# EAGLE design HackmodWear_workingcopy2 (EAGLE 9.2.0)
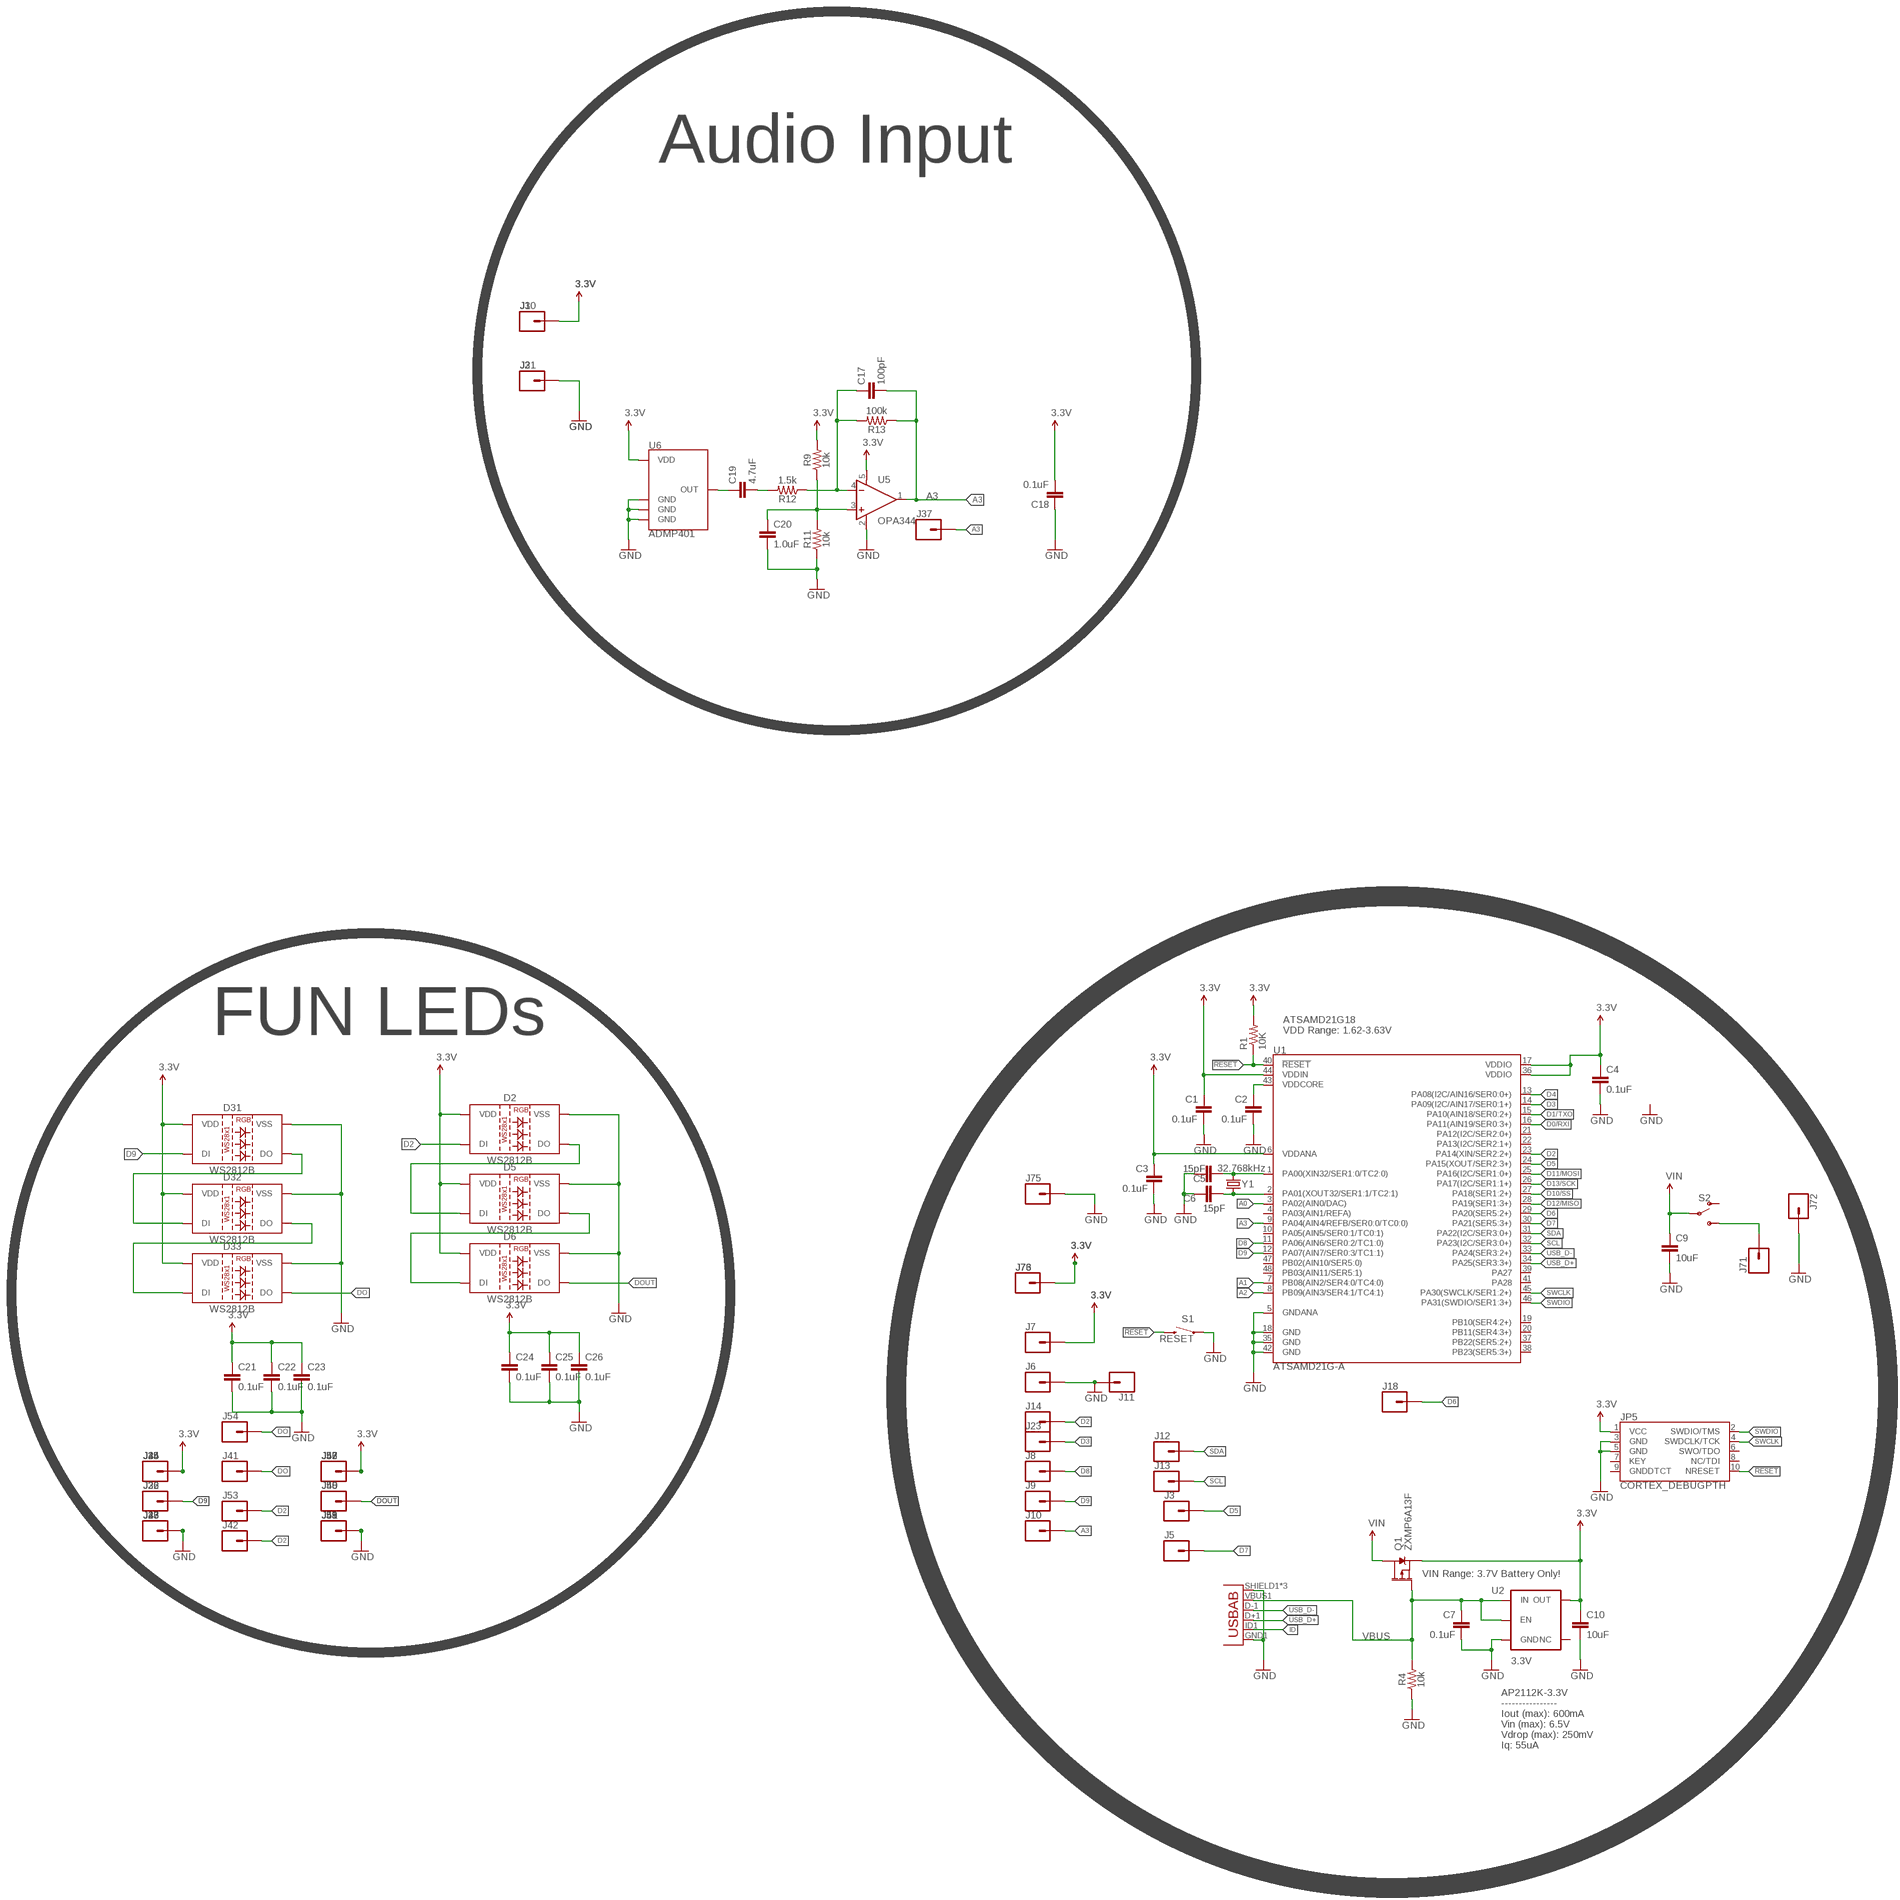
[diagram p0: schematic, sheet 1, part 1 of 3]
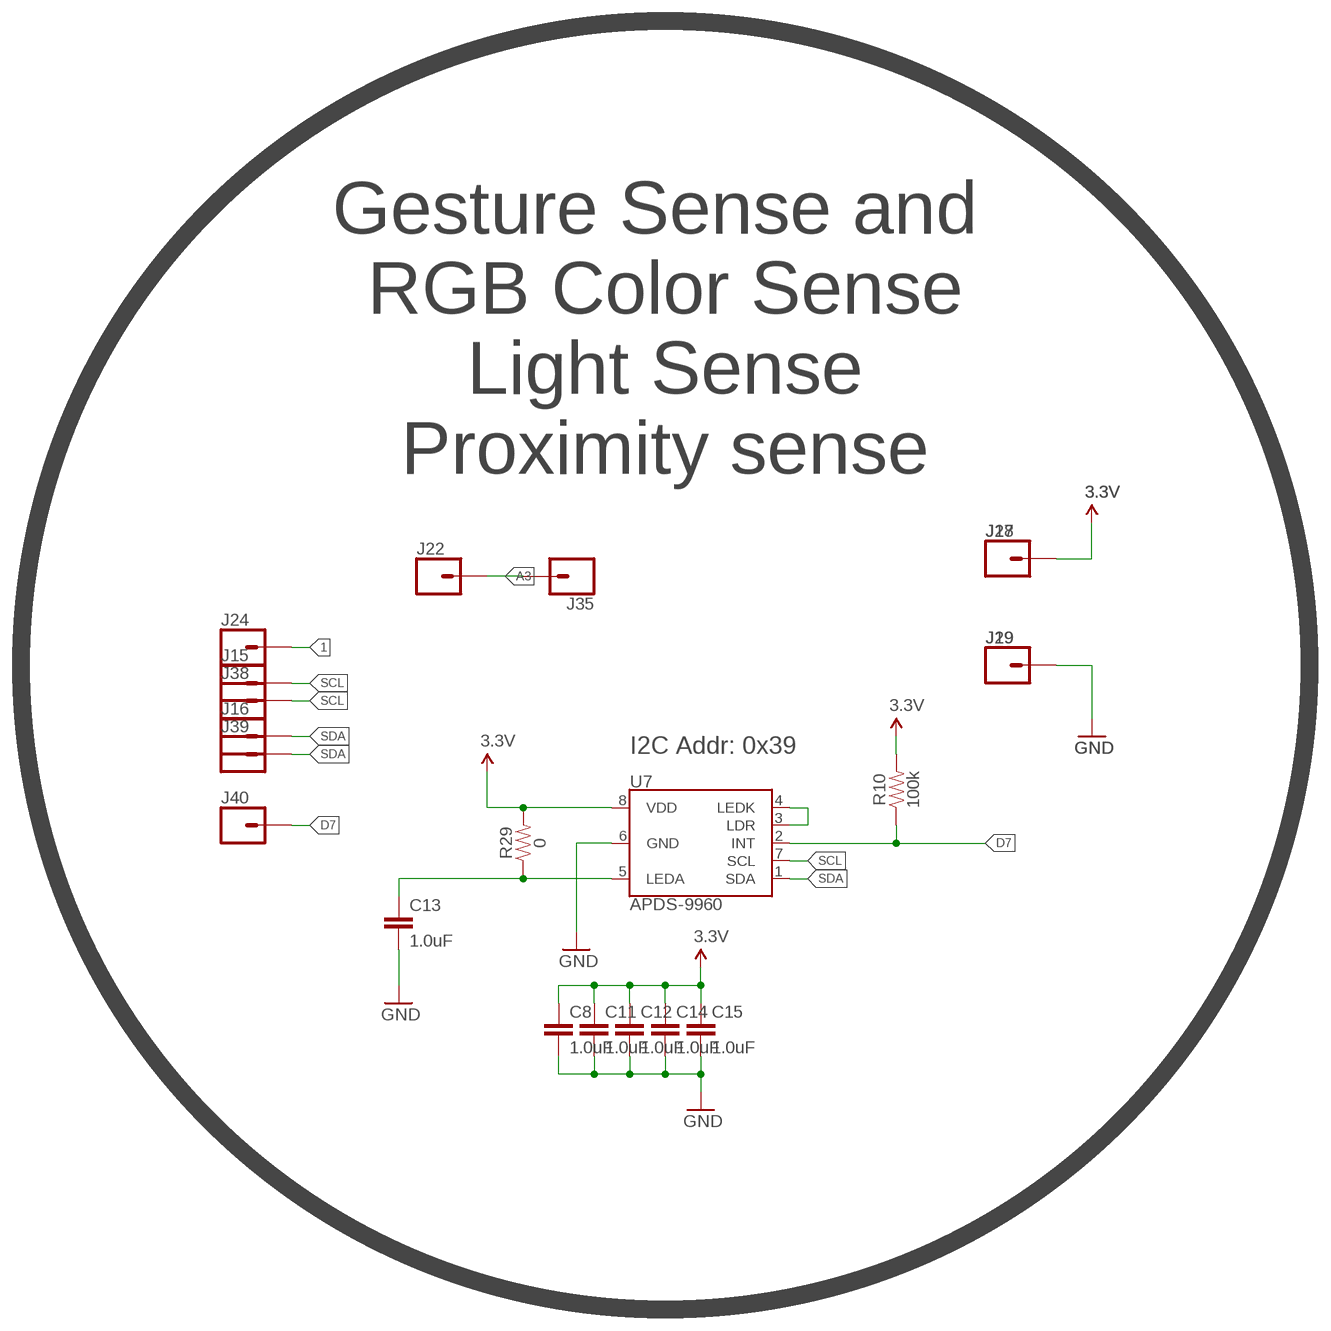
[diagram p1: schematic, sheet 1, part 2 of 3]
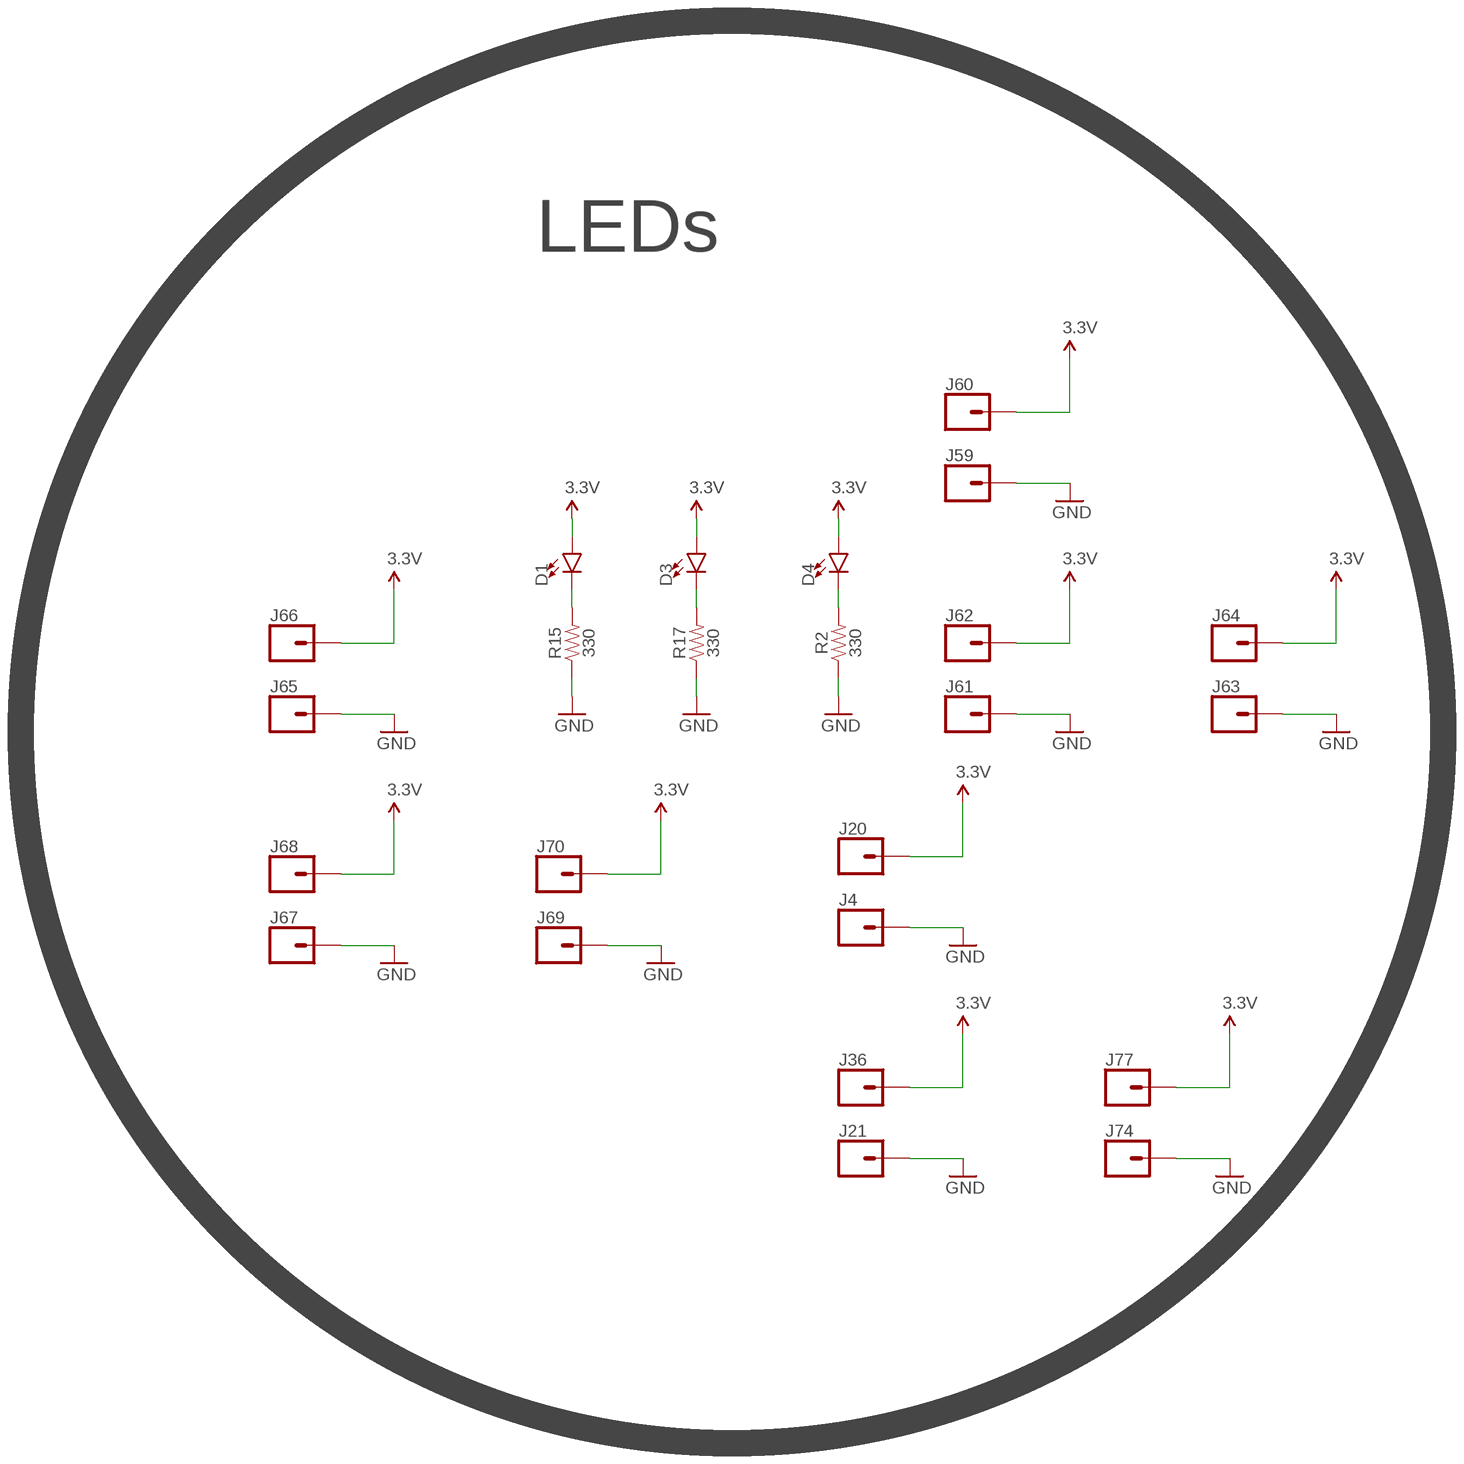
[diagram p2: schematic, sheet 1, part 3 of 3]

## Parts
C1  0.1uF  0.1UF-0603-25V-(+80/-20%)  [0603]
C2  0.1uF  0.1UF-0603-25V-(+80/-20%)  [0603]
C3  0.1uF  0.1UF-0603-25V-(+80/-20%)  [0603]
C4  0.1uF  0.1UF-0603-25V-(+80/-20%)  [0603]
C5  15pF  15PF-0603-50V-5%  [0603]
C6  15pF  15PF-0603-50V-5%  [0603]
C7  0.1uF  0.1UF-0603-25V-(+80/-20%)  [0603]
C8  1.0uF  1.0UF-0603-16V-10%  [0603]
C9  10uF  10UF-0603-6.3V-20%  [0603]
C10  10uF  10UF-0603-6.3V-20%  [0603]
C11  1.0uF  1.0UF-0603-16V-10%  [0603]
C12  1.0uF  1.0UF-0603-16V-10%  [0603]
C13  1.0uF  1.0UF-0603-16V-10%  [0603]
C14  1.0uF  1.0UF-0603-16V-10%  [0603]
C15  1.0uF  1.0UF-0603-16V-10%  [0603]
C17  100pF  100PF-0603-50V-5%  [0603]
C18  0.1uF  0.1UF-0603-25V-(+80/-20%)  [0603]
C19  4.7uF  4.7UF0603  [0603]
C20  1.0uF  1.0UF-0603-16V-10%  [0603]
C21  0.1uF  0.1UF-0603-25V-(+80/-20%)  [0603]
C22  0.1uF  0.1UF-0603-25V-(+80/-20%)  [0603]
C23  0.1uF  0.1UF-0603-25V-(+80/-20%)  [0603]
C24  0.1uF  0.1UF-0603-25V-(+80/-20%)  [0603]
C25  0.1uF  0.1UF-0603-25V-(+80/-20%)  [0603]
C26  0.1uF  0.1UF-0603-25V-(+80/-20%)  [0603]
D1  LED1206  [LED-1206]
D2  WS2812B  [WS2812B]
D3  LED1206  [LED-1206]
D4  LED1206  [LED-1206]
D5  WS2812B  [WS2812B]
D6  WS2812B  [WS2812B]
D31  WS2812B  [WS2812B]
D32  WS2812B  [WS2812B]
D33  WS2812B  [WS2812B]
J1  CONN_01  [1X01]
J2  CONN_01  [1X01]
J3  CONN_01  [1X01]
J4  CONN_01  [1X01]
J5  CONN_01  [1X01]
J6  CONN_01  [1X01]
J7  CONN_01  [1X01]
J8  CONN_01  [1X01]
J9  CONN_01  [1X01]
J10  CONN_01  [1X01]
J11  CONN_01  [1X01]
J12  CONN_01  [1X01]
J13  CONN_01  [1X01]
J14  CONN_01  [1X01]
J15  CONN_01  [1X01]
J16  CONN_01  [1X01]
J17  CONN_01  [1X01]
J18  CONN_01  [1X01]
J19  CONN_01  [1X01]
J20  CONN_01  [1X01]
J21  CONN_01  [1X01]
J22  CONN_01  [1X01]
J23  CONN_01  [1X01]
J24  CONN_01  [1X01]
J25  CONN_01  [1X01]
J26  CONN_01  [1X01]
J27  CONN_01  [1X01]
J28  CONN_01  [1X01]
J29  CONN_01  [1X01]
J30  CONN_01  [1X01]
J31  CONN_01  [1X01]
J32  CONN_01  [1X01]
J33  CONN_01  [1X01]
J34  CONN_01  [1X01]
J35  CONN_01  [1X01]
J36  CONN_01  [1X01]
J37  CONN_01  [1X01]
J38  CONN_01  [1X01]
J39  CONN_01  [1X01]
J40  CONN_01  [1X01]
J41  CONN_01  [1X01]
J42  CONN_01  [1X01]
J43  CONN_01  [1X01]
J44  CONN_01  [1X01]
J45  CONN_01  [1X01]
J46  CONN_01  [1X01]
J47  CONN_01  [1X01]
J48  CONN_01  [1X01]
J49  CONN_01  [1X01]
J50  CONN_01  [1X01]
J51  CONN_01  [1X01]
J52  CONN_01  [1X01]
J53  CONN_01  [1X01]
J54  CONN_01  [1X01]
J55  CONN_01  [1X01]
J56  CONN_01  [1X01]
J57  CONN_01  [1X01]
J58  CONN_01  [1X01]
J59  CONN_01  [1X01]
J60  CONN_01  [1X01]
J61  CONN_01  [1X01]
J62  CONN_01  [1X01]
J63  CONN_01  [1X01]
J64  CONN_01  [1X01]
J65  CONN_01  [1X01]
J66  CONN_01  [1X01]
J67  CONN_01  [1X01]
J68  CONN_01  [1X01]
J69  CONN_01  [1X01]
J70  CONN_01  [1X01]
J71  CONN_01  [1X01]
J72  CONN_01  [1X01]
J73  CONN_01  [1X01]
J74  CONN_01  [1X01]
J75  CONN_01  [1X01]
J76  CONN_01  [1X01]
J77  CONN_01  [1X01]
JP3  USB-ABCONN-11794  [USB-AB-MICRO-SMD_V03]
JP5  CORTEX_DEBUGPTH  [2X5-PTH-1.27MM]
Q1  ZXMP6A13F  MOSFET_PCH-SI2309DS  [SOT23-3]
R1  10K  10KOHM-1/10W-1%(0603)0603  [0603-RES@1]
R2  330  330OHM-0603-1/10W-1%  [0603]
R4  10k  10KOHM-0603-1/10W-1%  [0603]
R9  10k  10KOHM-0603-1/10W-1%  [0603]
R10  100k  100KOHM-0603-1/10W-1%  [0603]
R11  10k  10KOHM-0603-1/10W-1%  [0603]
R12  1.5k  1.5KOHM-0603-1/10W-1%  [0603]
R13  100k  100KOHM-0603-1/10W-1%  [0603]
R15  330  330OHM-0603-1/10W-1%  [0603]
R17  330  330OHM-0603-1/10W-1%  [0603]
R29  0  0OHM-0603-1/10W-5%  [0603]
S1  RESET  SWITCH-MOMENTARY-2SMD-4.6X2.8MM  [TACTILE_SWITCH_SMD_4.6X2.8MM]
S2  SWITCH-SPDT-SMD-RIGHT-ANGLE  [SWITCH_SPST_SMD_A]
U1  ATSAMD21G-A  [TQFP-48]
U2  3.3V  V_REG_AP2112K-3.3V  [SOT23-5]
U5  OPA344  [SOT23-5]
U6  ADMP401  [ADMP401]
U7  APDS-9960  [APDS-9960]
Y1  32.768kHz  CRYSTAL3.2X1.5MM  [CRYSTAL-SMD-3.2X1.5MM]

## Nets
1: J24.P$1
3.3V: C1.1 C4.1 C8.1 C10.1 C11.1 C12.1 C14.1 C15.1 C18.2 C21.1 C22.1 C23.1 C24.1 C25.1 C26.1 D1.A D2.1(VDD) D3.A D4.A D5.1(VDD) D6.1(VDD) D31.1(VDD) D32.1(VDD) D33.1(VDD) J1.P$1 J7.P$1 J17.P$1 J20.P$1 J25.P$1 J28.P$1 J30.P$1 J34.P$1 J36.P$1 J44.P$1 J45.P$1 J47.P$1 J52.P$1 J56.P$1 J57.P$1 J60.P$1 J62.P$1 J64.P$1 J66.P$1 J68.P$1 J70.P$1 J73.P$1 J76.P$1 J77.P$1 JP5.1(VCC) Q1.2(S) R1.2 R9.2 R10.2 R29.2 U1.17(VDDIO) U1.36(VDDIO) U1.44(VDDIN) U2.5(OUT) U5.5(V+) U6.5(VDD) U7.8(VDD)
!RESET: JP5.10(NRESET) R1.1 S1.3 S1.4 U1.40(!RESET!)
A0: U1.3(PA02(AIN0/DAC))
A1: U1.7(PB08(AIN2/SER4:0/TC4:0))
A2: U1.8(PB09(AIN3/SER4:1/TC4:1))
A3: C17.2 J10.P$1 J22.P$1 J35.P$1 J37.P$1 R13.1 U1.9(PA04(AIN4/REFB/SER0:0/TC0:0)) U5.1(OUT)
D0/RXI: U1.16(PA11(AIN19/SER0:3+))
D1/TXO: U1.15(PA10(AIN18/SER0:2+))
D2: D2.4(DI) J14.P$1 J42.P$1 J53.P$1 U1.23(PA14(XIN/SER2:2+))
D3: J23.P$1 U1.14(PA09(I2C/AIN17/SER0:1+))
D4: U1.13(PA08(I2C/AIN16/SER0:0+))
D5: J3.P$1 U1.24(PA15(XOUT/SER2:3+))
D6: J18.P$1 U1.29(PA20(SER5:2+))
D7: J5.P$1 J40.P$1 R10.1 U1.30(PA21(SER5:3+)) U7.2(INT)
D8: J8.P$1 U1.11(PA06(AIN6/SER0:2/TC1:0))
D9: D31.4(DI) J9.P$1 J26.P$1 J32.P$1 U1.12(PA07(AIN7/SER0:3/TC1:1))
D10/SS: U1.27(PA18(SER1:2+))
D11/MOSI: U1.25(PA16(I2C/SER1:0+))
D12/MISO: U1.28(PA19(SER1:3+))
D13/SCK: U1.26(PA17(I2C/SER1:1+))
DO: D33.2(DO) J41.P$1 J54.P$1
DOUT: D6.2(DO) J48.P$1 J50.P$1
GND: C1.2 C2.2 C3.2 C4.2 C5.1 C6.2 C7.2 C8.2 C9.2 C10.2 C11.2 C12.2 C13.2 C14.2 C15.2 C18.1 C20.2 C21.2 C22.2 C23.2 C24.2 C25.2 C26.2 D2.3(VSS) D5.3(VSS) D6.3(VSS) D31.3(VSS) D32.3(VSS) D33.3(VSS) J2.P$1 J4.P$1 J6.P$1 J11.P$1 J19.P$1 J21.P$1 J27.P$1 J29.P$1 J31.P$1 J33.P$1 J43.P$1 J46.P$1 J49.P$1 J51.P$1 J55.P$1 J58.P$1 J59.P$1 J61.P$1 J63.P$1 J65.P$1 J67.P$1 J69.P$1 J72.P$1 J74.P$1 J75.P$1 JP3.GND1(GND) JP3.SHIELD1(SHIELD) JP3.SHIELD2(SHIELD) JP3.SHIELD3(SHIELD) JP5.3(GND) JP5.5(GND) R2.1 R4.1 R11.1 R15.1 R17.1 S1.1 S1.2 U1.5(GNDANA) U1.18(GND) U1.35(GND) U1.42(GND) U2.2(GND) U5.2(V-) U6.2(GND) U6.4(GND) U6.6(GND) U7.6(GND)
ID: JP3.ID1(USBID)
LEDA: C13.1 R29.1 U7.5(LEDA)
N$1: D4.C R2.2
N$2: C5.2 U1.1(PA00(XIN32/SER1:0/TC2:0)) Y1.P$2
N$3: C19.1 U6.1(OUT)
N$4: C6.1 U1.2(PA01(XOUT32/SER1:1/TC2:1)) Y1.P$1
N$5: U7.3(LDR) U7.4(LEDK)
N$6: C17.1 R12.1 R13.2 U5.4(-IN)
N$10: C19.2 R12.2
N$11: C20.1 R9.1 R11.2 U5.3(+IN)
N$12: D1.C R15.2
N$14: D31.2(DO) D32.4(DI)
N$15: D3.C R17.2
N$16: D32.2(DO) D33.4(DI)
N$21: J71.P$1 S2.3(S)
N$22: D2.2(DO) D5.4(DI)
N$23: D5.2(DO) D6.4(DI)
SCL: J13.P$1 J15.P$1 J38.P$1 U1.32(PA23(I2C/SER3:0+)) U7.7(SCL)
SDA: J12.P$1 J16.P$1 J39.P$1 U1.31(PA22(I2C/SER3:0+)) U7.1(SDA)
SWCLK: JP5.4(SWDCLK/TCK) U1.45(PA30(SWCLK/SER1:2+))
SWDIO: JP5.2(SWDIO/TMS) U1.46(PA31(SWDIO/SER1:3+))
USB_D+: JP3.D+1(D+) U1.34(PA25(SER3:3+))
USB_D-: JP3.D-1(D-) U1.33(PA24(SER3:2+))
VBUS: C7.1 JP3.VBUS1(VBUS) Q1.1(G) R4.2 U2.1(IN) U2.3(EN)
VDDANA: C3.1 U1.6(VDDANA) ; supply symbol labelled 3.3V
VDDCORE: C2.1 U1.43(VDDCORE)
VIN: C9.1 Q1.3(D) S2.2(P)
Unconnected: JP5.6(SWO/TDO) JP5.7(KEY) JP5.8(NC/TDI) JP5.9(GNDDTCT) S2.1(O) U1.4(PA03(AIN1/REFA)) U1.10(PA05(AIN5/SER0:1/TC0:1)) U1.19(PB10(SER4:2+)) U1.20(PB11(SER4:3+)) U1.21(PA12(I2C/SER2:0+)) U1.22(PA13(I2C/SER2:1+)) U1.37(PB22(SER5:2+)) U1.38(PB23(SER5:3+)) U1.39(PA27) U1.41(PA28) U1.47(PB02(AIN10/SER5:0)) U1.48(PB03(AIN11/SER5:1)) U2.4(NC)

## Notes on the sheet
- Audio Input
- ATSAMD21G18
  VDD Range: 1.62-3.63V
- FUN LEDs
- LEDs
- VIN Range: 3.7V Battery Only!
- AP2112K-3.3V
  ----------------
  Iout (max): 600mA 
  Vin (max): 6.5V
  Vdrop (max): 250mV
  Iq: 55uA
- Gesture Sense and 
  RGB Color Sense
  Light Sense
  Proximity sense
- I2C Addr: 0x39

## Library data of the parts
C1-C4 C7 C18 C21-C26 = SparkFun-Capacitors:0.1UF: 0.1µF ceramic capacitors A capacitor is a passive two-terminal electrical component used to store electrical energy temporarily in an electric field.; PROD_ID: CAP-00810
C5 C6 = SparkFun-Capacitors:15PF: 15pF ceramic capacitors A capacitor is a passive two-terminal electrical component used to store electrical energy temporarily in an electric field.; PROD_ID: CAP-07881
C8 C11-C15 C20 = SparkFun-Capacitors:1.0UF: 1µF ceramic capacitors A capacitor is a passive two-terminal electrical component used to store electrical energy temporarily in an electric field.; PROD_ID: CAP-00868
C9 C10 = SparkFun-Capacitors:10UF: 10.0µF ceramic capacitors A capacitor is a passive two-terminal electrical component used to store electrical energy temporarily in an electric field.; PROD_ID: CAP-11015
C17 = SparkFun-Capacitors:100PF: 100pF/0.1nF ceramic capacitors A capacitor is a passive two-terminal electrical component used to store electrical energy temporarily in an electric field.; PROD_ID: CAP-07883
C19 = SparkFun-Capacitors:4.7UF: 4.7µF ceramic capacitors A capacitor is a passive two-terminal electrical component used to store electrical energy temporarily in an electric field.; PROD_ID: CAP-08280
D1 D3 D4 = SparkFun-LED:LED: LED (Generic) Standard schematic elements and footprints for 5mm, 3mm, 1206, and 0603 sized LEDs. Generic LEDs with no color specified.
D2 D5 D6 D31-D33 = SparkFun-LED:WS2812B: WS2812B SMD addressable RGB LED 5x5mm SMD LED with built-in controller IC. Color: Red/Green/Blue mC Rating: RGB: 390, 660, 180 mcd Forward Voltage: RGB: 2.0, 3.0, 3.0 V Packages:WS2812B SparkFun Products: Blynk Board - ESP8266 <https://www.sparkfun.com/products/13794>; PROD_ID: DIO-12503
J1-J77 = SparkFun-Connectors:CONN_01: Single connection point. Often used as Generic Header-pin footprint for 0.1 inch spaced/style header connections On any of the 0.1 inch spaced packages, you can populate with these: Break Away Headers - Straight <https://www.sparkfun.com/products/116> (PRT-00116) Break Away Male Headers - Right Angle <https://www.sparkfun.com/products/553> (PRT-00553) Female Headers <https://www.sparkfun.com/products/115> (PRT-00115) Break Away Headers - Machine Pin <https://www.sparkfun.com/products/117> (PRT-00117) Break Away Female Headers - Swiss Machine Pin <https://www.sparkfun.com/products/743> (PRT-00743) This device is also useful as a general connection point to wire up your design to another part of your project. Our various solder wires solder well into these plated through hole pads. Hook-Up Wire - Assortment (Stranded, 22 AWG) <https://www.sparkfun.com/products/11375> (PRT-11375) Hook-Up Wire - Assortment (Solid Core, 22 AWG) <https://www.sparkfun.com/products/11367> (PRT-11367) View the entire wire category on our website here <https://www.sparkfun.com/categories/141> Special notes: SMTSO-256-ET is a "flush mount" nut for a 4-40 screw. We mostly use this on specialty testbeds; it is a nice way to connect hardware to your PCB at an adjustable hieght. Also note, the SNAP packages are for using a snappable style connector. We sell a baggie of snaps and they are also used on two LilyPad designs: Snap Assortment - 30 pack (male and female) <https://www.sparkfun.com/products/11347> (DEV-11347) LilyPad Arduino SimpleSnap <https://www.sparkfun.com/products/10941> (DEV-10941) LilyPad SimpleSnap Protoboard <https://www.sparkfun.com/products/10940> (DEV-10940)
JP3 = SparkFun-Connectors:USB-AB: This is a USB AB connector that is compatible with USB OTG. i.e. this connector can serve as a host or device; PROD_ID: CONN-11794
JP5 = samd21-temp:CORTEX_DEBUG: Cortex Debug Connector Datasheet <http://infocenter.arm.com/help/topic/com.arm.doc.faqs/attached/13634/cortex_debug_connectors.pdf>
Q1 = SparkFun-DiscreteSemi:MOSFET_PCH: P-channel MOSFETs Voltage controlled devices that allow control of high current outputs. SparkFun Products: SparkFun ESP32 Thing <https://www.sparkfun.com/products/13907> SparkFun ESP8266 Thing <https://www.sparkfun.com/products/13231>; PROD_ID: TRANS-08285; VALUE: 1.1A/60V/600mΩ
R1 = SparkFun-Resistors:10KOHM-1/10W-1%(0603): RES-00824; PROD_ID: RES-00824
R2 R15 R17 = SparkFun-Resistors:330OHM: 330Ω resistor A resistor is a passive two-terminal electrical component that implements electrical resistance as a circuit element. Resistors act to reduce current flow, and, at the same time, act to lower voltage levels within circuits. - Wikipedia; PROD_ID: RES-00818
R4 R9 R11 = SparkFun-Resistors:10KOHM: 10kΩ resistor A resistor is a passive two-terminal electrical component that implements electrical resistance as a circuit element. Resistors act to reduce current flow, and, at the same time, act to lower voltage levels within circuits. - Wikipedia; PROD_ID: RES-00824
R10 R13 = SparkFun-Resistors:100KOHM: 100kΩ resistor A resistor is a passive two-terminal electrical component that implements electrical resistance as a circuit element. Resistors act to reduce current flow, and, at the same time, act to lower voltage levels within circuits. - Wikipedia; PROD_ID: RES-07828
R12 = SparkFun-Resistors:1.5KOHM: 1.5kΩ resistor A resistor is a passive two-terminal electrical component that implements electrical resistance as a circuit element. Resistors act to reduce current flow, and, at the same time, act to lower voltage levels within circuits. - Wikipedia; PROD_ID: RES-08306
R29 = SparkFun-Resistors:0OHM: 0Ω resistor A resistor is a passive two-terminal electrical component that implements electrical resistance as a circuit element. Resistors act to reduce current flow, and, at the same time, act to lower voltage levels within circuits. - Wikipedia; PROD_ID: RES-08609
S1 = samd21-temp:SWITCH-MOMENTARY-2: Various NO switches- pushbuttons, reed, etc; PROD_ID: SWCH-13065
S2 = SparkFun-Switches:SWITCH-SPDT: Single Pole, Double Throw (SPDT) Switch Single-pole, double-throw (SPDT) switch. Variant Overview SMD-AYZ0202 Surface Mount DPDT Switch <https://www.sparkfun.com/products/597> (COM-00597) Used on e.g. LilyPad Arduino USB - ATmega32U4 Board <https://www.sparkfun.com/products/12049> PTH-11.6X4.0MM SPDT Mini Power Switch <https://www.sparkfun.com/products/102> (COM-00102) Used on e.g. SparkFun Simon Says - Through-Hole Soldering Kit <https://www.sparkfun.com/products/10547> (KIT-10547) PTH-11.6X4.0MM-KIT KIT version of SPDT Mini Power Switch - Simplifies soldering by removing tStop of switch pins - only one side can be soldered. PTH-11.6X4.0MM-LOCK LOCK version of SPDT Mini Power Switch - Offset pins hold switch in place for easier soldering. SMD-RIGHT-ANGLE Surface Mount Right Angle Switch <https://www.sparkfun.com/products/10860> (COM-10860) Used on e.g. SparkFun ESP8266 Thing <https://www.sparkfun.com/products/13231>; PROD_ID: SWCH-10651; SF_SKU: COM-10860
U1 = samd21-temp:ATSAMD21G: Atmel SAMD21G SMART ARM-Based Microcontroller The Atmel ® | SMART ™ SAM D21 is a series of low-power microcontrollers using the 32-bit ARM ® Cortex ® -M0+ processor, and ranging from 32- to 64-pins with up to 256KB Flash and 32KB of SRAM. The SAM D21 devices operate at a maximum frequency of 48MHz and reach 2.46 CoreMark/MHz. They are designed for simple and intuitive migration with identical peripheral modules, hex compatible code, identical linear address map and pin compatible migration paths between all devices in the product series. All devices include intelligent and flexible peripherals, Atmel Event System for inter-peripheral signaling, and support for capacitive touch button, slider and wheel user interfaces.; PROD_ID: IC-13064
U2 = SparkFun-PowerIC:V_REG_AP2112: AP2112 - 600mA CMOS LDO Regulator w/ Enable The AP2112 is CMOS process low dropout linear regulator with enable function, the regulator delivers a guaranteed 600mA (min.) continuous load current. Features Output Voltage Accuracy: ±1.5% Output Current: 600mA (Min.) Foldback Short Current Protection: 50mA Enable Function to Turn ON/OFF VOUT Low Dropout Voltage (3.3V): 250mV (Typ.) @IOUT=600mA Excellent Load Regulation: 0.2%/A (Typ.) Excellent Line Regulation: 0.02%/V (Typ.) Low Quiescent Current: 55μA (Typ.) Low Standby Current: 0.01μA (Typ.) Low Output Noise: 50μVRMS PSRR: 100Hz -65dB, 1kHz -65dB OTSD Protection Stable with 1.0μF Flexible Cap: Ceramic, Tantalum and Aluminum Electrolytic Operation Temperature Range: -40°C to 85°C ESD: MM 400V, HBM 4000V; PROD_ID: VREG-12457
U5 = SparkFun:OPA344
U6 = SparkFun-Sensors:ADMP401: ADMP401 - Omnidirection Bottom-Port MEMS Microphone The ADMP401 is a high quality, low cost, low power analog output bottom-ported omnidirectional MEMS microphone. The ADMP401 consists of a MEMS microphone element, an impedance converter, and an output amplifier. The ADMP401 sensitivity specification makes it an excellent choice for both near field and far field applications. Datasheet <http://www.analog.com/media/en/technical-documentation/obsolete-data-sheets/ADMP401.pdf> SparkFun Products SparkFun MEMS Microphone Breakout - INMP401 (ADMP401) <https://www.sparkfun.com/products/9868> (BOB-09868) MEMS Microphone - INMP401 (ADMP401) <https://www.sparkfun.com/products/10028> (COM-10028); PROD_ID: IC-09773
U7 = SparkFun-Sensors:APDS-9960: Avago APDS-9960 Digital Proximity, Ambient Light, RGB, and Gesture Sensor. The APDS-9960 offers ambient light and color measuring, proximity detection, and touchless gesture sensing. It features UV and IR blocking filters, four separate diodes sensitive to different directions, and an I2C compatible interface. Datasheet <https://cdn.sparkfun.com/datasheets/Sensors/Proximity/apds9960.pdf> SparkFun Products SparkFun RGB and Gesture Sensor - APDS-9960 <https://www.sparkfun.com/products/12787> (SEN-12787); PROD_ID: SEN-12005
Y1 = samd21-temp:CRYSTAL: Various standard crystals. Proven footprints.; PROD_ID: XTAL-13062

## Board
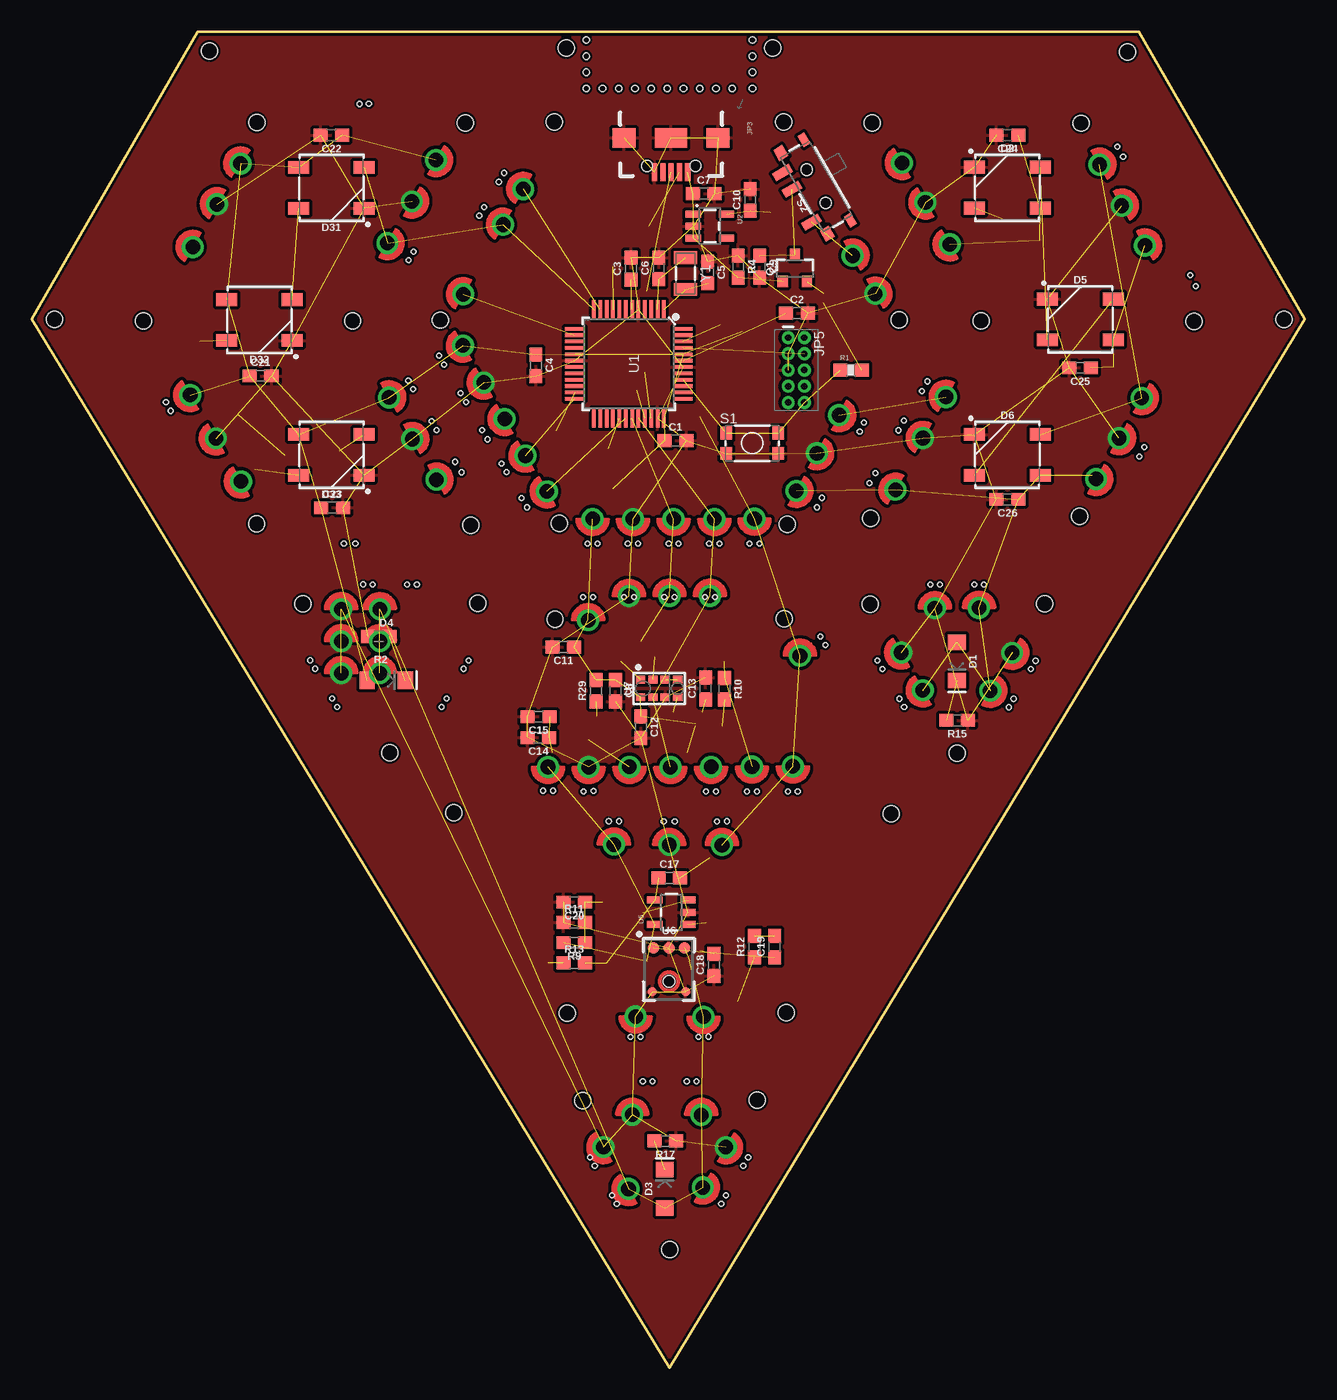
[diagram p3: board, top side]
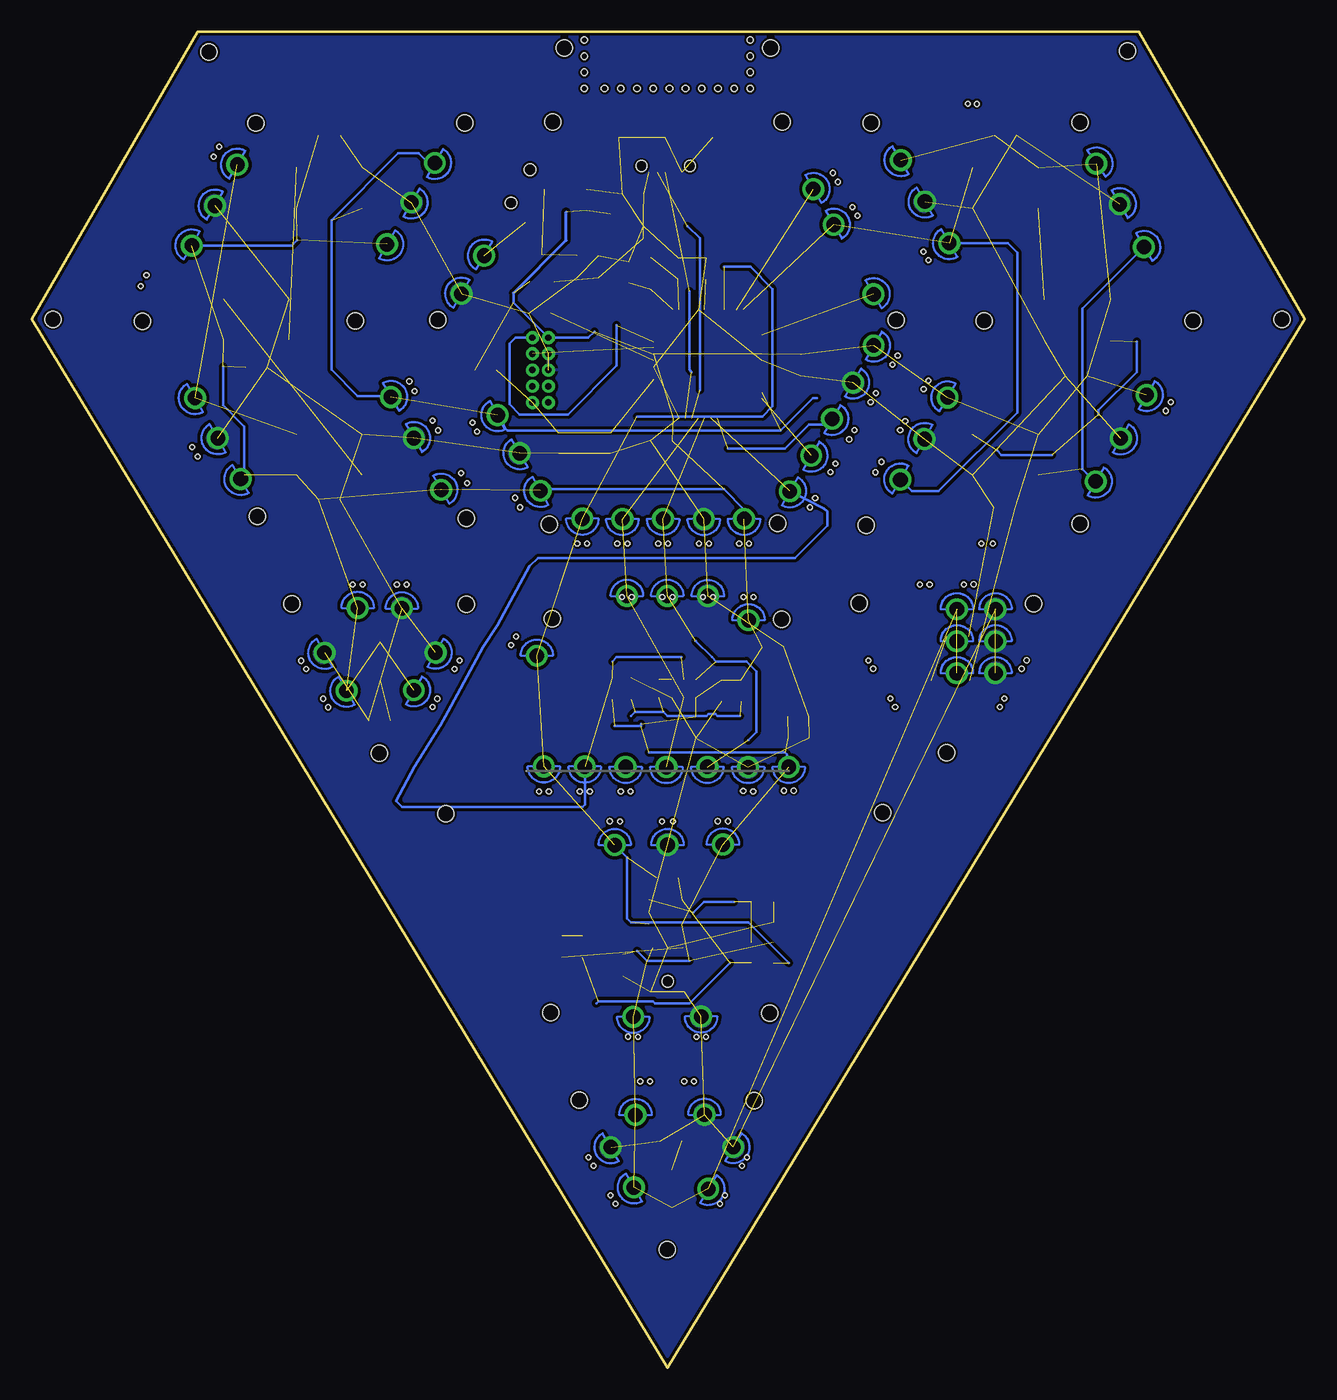
[diagram p4: board, bottom side, seen from below]

Size 99.85 x 104.77 mm. Coordinates in mm from the lower left corner, seen from the top.
Outline: 13.02,104.78 86.84,104.78 99.85,82.23 50.01,0 0,82.23 13.02,104.78
Copper layers (1*16): Top 0.035mm / dielectric 1.5mm / Bottom 0.035mm
Design rules "SparkFun-2-layer-STANDARD": minimum track width 10mil, minimum drill 20mil, track to track 10mil, track to pad 8mil, pad to pad 8mil, via to via 10mil, smd to smd 8mil, copper to edge 8mil, drill to drill 8mil, minimum pad ring 10mil, minimum via ring 10mil, stop-mask expansion 4mil, vias tented up to drill 25mil, thermal gap 10mil
Holes 1.27 mm at 34.43,66.09 34.02,97.62 41.99,27.8 67.4,43.43 59.27,66.13 21.27,59.91 28.09,48.22 41.91,103.5 59.17,27.84 34.97,59.95 85.96,103.18 65.91,97.63 65.79,66.61 82.3,97.61 41.04,58.68 59.03,58.76 41.37,66.21 32.06,82.16 40.99,97.73 8.76,82.12 17.63,97.66 17.63,66.2 74.47,82.11 82.17,66.76 58.1,103.5 25.16,82.09 13.92,103.27 33.11,43.53 58.99,97.72 68.03,82.18 91.18,82.08 1.79,82.22 98.2,82.24 65.76,59.89 72.58,48.2 79.46,59.93 43.21,20.93 50.03,9.24 56.91,20.97
Holes 0.51 mm at 43.5,100.33 43.5,101.6 43.5,102.87 43.5,104.14 56.52,100.33 56.52,101.6 56.52,102.87 56.52,104.14 48.58,100.33 47.31,100.33 46.04,100.33 44.77,100.33 53.66,100.33 52.39,100.33 51.12,100.33 49.85,100.33 54.93,100.33
Holes 0.38 mm at 25.72,99.12 26.44,99.13 29.54,86.87 29.93,87.55 29.53,77.42 29.9,76.75 31.35,74.24 31.74,73.54 33.21,71.05 33.7,70.22 31.94,79.38 32.34,78.68 33.64,76.44 34.06,75.72 35.74,72.82 35.32,73.55 36.83,70.92 37.22,70.24 38.41,68.2 38.83,67.49 43.59,64.63 44.37,64.64 46.74,64.64 47.54,64.64 49.96,64.64 50.72,64.64 53.13,64.64 53.93,64.64 56.29,64.63 57.07,64.64 61.86,57.34 62.26,56.67 53.57,60.45 52.79,60.44 50.41,60.45 49.6,60.45 47.22,60.44 46.44,60.44 44.02,60.46 43.24,60.45 25.98,61.44 25.37,64.63 24.47,64.64 26.74,61.43 29.43,61.43 30.2,61.44 40.09,45.26 40.87,45.26 43.27,45.21 44.06,45.22 52.88,45.19 53.66,45.19 56.1,45.21 56.87,45.21 45.25,42.86 46.05,42.86 49.57,42.85 50.43,42.84 87.27,72.21 86.86,71.47 91.31,84.82 90.87,85.68 85.6,94.99 85.15,95.76 70.24,77.36 65.27,74.13 69.82,76.61 68.41,74.29 67.98,73.51 66.18,70.17 65.71,69.37 35.09,90.36 35.48,91.02 10.51,75.73 10.89,75.05 36.63,93.01 37.03,93.71 64.93,73.42 61.57,67.48 61.96,68.23 60.07,45.2 59.31,45.2 53.73,42.84 54.52,42.86 46.97,25.95 47.73,25.95 52.3,25.95 53.09,25.96 23.93,51.83 23.56,52.49 22.21,54.82 21.83,55.48 34.25,55.47 33.86,54.81 32.52,52.48 32.14,51.82 70.47,61.42 71.23,61.41 73.92,61.41 74.69,61.42 68.42,51.81 68.05,52.47 66.7,54.8 66.32,55.46 78.74,55.45 78.35,54.79 77.01,52.46 76.63,51.8 47.92,22.46 48.68,22.45 51.37,22.45 52.14,22.46 45.87,12.85 45.5,13.51 44.15,15.84 43.77,16.5 56.19,16.49 55.8,15.83 54.46,13.5 54.08,12.84

### Footprints (pad centres in the part's own frame; a part is rotated, then mirrored left to right if it is on the bottom)
0603 = smd 1.1 x 1: 1 -0.85,0; 2 0.85,0
LED-1206 = smd 1.2 x 1.4: A -1.5,0; C 1.5,0
WS2812B = smd 1.651 x 1: 1 2.577,-1.6; 2 2.577,1.6; 3 -2.577,1.6; 4 -2.577,-1.6
1X01 = drill 1.143: P$1 0,0
USB-AB-MICRO-SMD_V03 = smd 1.4 x 0.4: D+1 2.7,0; D-1 2.7,0.65; GND1 2.7,-1.3; ID1 2.7,-0.65; VBUS1 2.7,1.3 | smd 1.5 x 1.8: SHIELD1 0,3.68; SHIELD3 0,-3.68 | smd 1.5 x 2.5: SHIELD2 0,0 | hole 0.85: 2.2,1.9; 2.2,-1.9
2X5-PTH-1.27MM = drill 0.508 pad 1: 1 -2.54,-0.635; 2 -2.54,0.635; 3 -1.27,-0.635; 4 -1.27,0.635; 5 0,-0.635; 6 0,0.635; 7 1.27,-0.635; 8 1.27,0.635; 9 2.54,-0.635; 10 2.54,0.635
SOT23-3 = smd 0.8 x 0.9: 1 -0.95,-1; 2 0.95,-1; 3 0,1.1
0603-RES@1 = smd 1.1 x 1: 1 -0.85,0; 2 0.85,0
TACTILE_SWITCH_SMD_4.6X2.8MM = smd 0.9 x 1: 1 -2.05,-0.8; 2 2.05,-0.8; 3 2.05,0.8; 4 -2.05,0.8
SWITCH_SPST_SMD_A = smd 0.7 x 1.5: 1 -2.25,-1.75; 2 -0.75,-1.75; 3 2.25,-1.75 | smd 1 x 0.6: GND1 -3.65,1; GND3 3.65,1 | smd 1 x 0.8: GND2 -3.65,-1.1; GND4 3.65,-1.1 | hole 0.9: -1.5,0; 1.5,0
TQFP-48 = smd 1.5 x 0.28: 1 -4.25,2.75; 2 -4.25,2.25; 3 -4.25,1.75; 4 -4.25,1.25; 5 -4.25,0.75; 6 -4.25,0.25; 7 -4.25,-0.25; 8 -4.25,-0.75; 9 -4.25,-1.25; 10 -4.25,-1.75; 11 -4.25,-2.25; 12 -4.25,-2.75; 25 4.25,-2.75; 26 4.25,-2.25; 27 4.25,-1.75; 28 4.25,-1.25; 29 4.25,-0.75; 30 4.25,-0.25; 31 4.25,0.25; 32 4.25,0.75; 33 4.25,1.25; 34 4.25,1.75; 35 4.25,2.25; 36 4.25,2.75 | smd 0.28 x 1.5: 13 -2.75,-4.25; 14 -2.25,-4.25; 15 -1.75,-4.25; 16 -1.25,-4.25; 17 -0.75,-4.25; 18 -0.25,-4.25; 19 0.25,-4.25; 20 0.75,-4.25; 21 1.25,-4.25; 22 1.75,-4.25; 23 2.25,-4.25; 24 2.75,-4.25; 37 2.75,4.25; 38 2.25,4.25; 39 1.75,4.25; 40 1.25,4.25; 41 0.75,4.25; 42 0.25,4.25; 43 -0.25,4.25; 44 -0.75,4.25; 45 -1.25,4.25; 46 -1.75,4.25; 47 -2.25,4.25; 48 -2.75,4.25
SOT23-5 = smd 0.55 x 1.2: 1 -0.95,-1.3; 2 0,-1.3; 3 0.95,-1.3; 4 0.95,1.3; 5 -0.95,1.3
ADMP401 = smd 0.9 x 0.9: 1 -1.2,2.62; 5 1.2,2.62; 6 0,2.62 | smd 0.7 x 0.7: 2 1.3,-0.8; 4 -1.3,-0.8 | hole 0.9: 0,0
APDS-9960 = smd 0.6 x 0.72: 1 0.7,1.455; 2 0.7,0.485; 3 0.7,-0.485; 4 0.7,-1.455; 5 -0.7,-1.455; 6 -0.7,-0.485; 7 -0.7,0.485; 8 -0.7,1.455
CRYSTAL-SMD-3.2X1.5MM = smd 1 x 1.8: P$1 -1.25,0; P$2 1.25,0

### Placement (x,y rotation side)
C1  50.48,72.71 0 top
C2  60.01,82.71 0 top
C3  46.99,86.2 90 top
C4  39.53,78.61 270 top
C5  53.02,85.92 270 top
C6  49.17,86.23 90 top
C7  52.71,92.08 0 top
C8  45.78,53.1 270 top
C9  57.09,86.36 270 top
C10  56.36,91.6 90 top
C11  41.69,56.53 180 top
C12  47.76,50.24 270 top
C13  52.85,53.27 90 top
C14  39.71,49.42 180 top
C15  39.74,51.06 180 top
C17  50.01,38.42 0 top
C18  53.5,31.59 90 top
C19  58.26,33.02 90 top
C20  42.55,36.51 180 top
C21  17.94,77.79 0 top
C22  23.49,96.68 180 top
C23  23.55,67.45 0 top
C24  76.52,96.68 180 top
C25  82.23,78.42 180 top
C26  76.52,68.1 180 top
D1  72.56,55.4 270 top
D2  76.52,92.55 0 top
D3  49.65,14.03 90 top
D4  27.79,53.92 0 top
D5  82.24,82.22 0 top
D6  76.52,71.6 0 top
D31  23.5,92.53 180 top
D32  17.85,82.17 180 top
D33  23.49,71.6 180 top
J1  52.68,27.52 180 top
J2  47.36,27.55 180 top
J3  38.72,71.54 120 top
J4  24.26,59.49 0 top
J5  40.4,68.74 120 top
J6  35.45,77.27 120 top
J7  67.75,68.86 60 top
J8  38.55,92.45 60 top
J9  36.96,89.65 60 top
J10  56.68,66.59 180 top
J11  47.15,66.57 180 top
J12  50.34,66.58 180 top
J13  50.08,47.11 180 top
J14  63.32,74.71 243 top
J15  53.18,60.53 0 top
J16  50.01,60.53 0 top
J17  43.64,58.62 0 top
J18  37.08,74.42 120 top
J19  46.83,60.52 0 top
J20  27.29,59.49 0 top
J21  24.26,56.98 0 top
J22  60.25,55.84 0 top
J23  33.84,84.19 60 top
J24  53.28,47.12 180 top
J25  31.7,94.72 240 top
J26  31.72,69.65 300 top
J27  14.53,91.26 60 top
J28  40.49,47.12 180 top
J29  43.67,47.11 180 top
J30  45.65,41.03 0 top
J31  49.99,41 0 top
J32  27.89,88.21 240 top
J33  29.83,72.83 300 top
J34  28.02,76.1 300 top
J35  59.69,47.16 180 top
J36  27.29,56.98 0 top
J37  54.13,40.99 0 top
J38  53.54,66.57 180 top
J39  46.87,47.12 180 top
J40  56.48,47.15 180 top
J41  16.41,69.51 120 top
J42  71.7,76.14 60 top
J43  29.81,91.47 240 top
J44  16.36,94.44 55 top
J45  12.42,76.3 120 top
J46  14.44,72.89 120 top
J47  72,88.11 120 top
J48  83.74,94.35 300 top
J49  85.49,91.14 300 top
J50  87.05,76.06 240 top
J51  70.09,91.4 120 top
J52  87.31,88.02 300 top
J53  68.25,94.49 120 top
J54  12.62,87.9 60 top
J55  69.89,72.91 60 top
J56  33.82,80.17 120 top
J57  83.48,69.71 240 top
J58  85.27,72.91 240 top
J59  76.9,56.07 240 top
J60  75.17,53.1 240 top
J61  68.19,56.09 120 top
J62  69.89,53.13 120 top
J63  70.83,59.56 0 top
J64  74.3,59.59 0 top
J65  47.09,19.84 0 top
J66  52.63,14.14 240 top
J67  44.84,17.3 120 top
J68  46.8,14.02 120 top
J69  54.44,17.29 240 top
J70  52.51,19.82 0 top
J71  64.37,87.22 300 top
J72  66.15,84.23 300 top
J73  43.99,66.58 180 top
J74  24.26,54.47 0 top
J75  61.58,71.73 240 top
J76  59.96,68.78 240 top
J77  27.29,54.47 0 top
JP3  50.15,96.46 270 top
JP5  59.96,78.25 270 top
Q1  59.85,86.2 0 top
R1  64.26,78.24 0 top
R2  27.21,57.36 0 top
R4  55.4,86.36 270 top
R9  42.55,33.34 180 top
R10  54.33,53.24 270 top
R11  42.55,34.92 0 top
R12  56.67,33.02 90 top
R13  42.55,31.75 0 top
R15  72.59,50.78 180 top
R17  49.69,17.78 180 top
R29  44.25,53.09 90 top
S1  56.5,72.51 0 top
S2  61.53,92.67 300 top
U1  46.83,78.74 270 top
U2  53.18,89.53 270 top
U5  50.16,35.72 90 top
U6  49.97,30.29 0 top
U7  49.2,53.27 90 top
Y1  51.28,85.82 270 top

### Tracks (layer width: path | path; a pad name or v marks a point on that pad's centre or on a via)
3.3V  (61 unrouted)
  Bottom 0.178: 55.72,81.28 56.21,80.79 JP5.1 62.07,83.53 62.07,84.3 | J73.P$1 43.99,67.32 45.56,68.9 59.05,68.9 59.18,68.78 J76.P$1 | J52.P$1 79.46,88.02 79.06,88.42 | 54.13,50.32 52.07,50.32 52.07,50.48 | 51.44,48.26 40.8,48.26 40.64,48.1 40.64,47.27 J28.P$1 | 48.26,31.91 51.59,31.91 52.39,32.7 | 84.85,78.5 84.85,75.49 83.18,73.82 83.18,70 83.23,69.96 83.18,69.88 83.35,69.71 J57.P$1
  Bottom 0.254: 62.07,84.3 57.94,88.42 57.94,90.65
!RESET  (4 unrouted)
A3  (8 unrouted)
  Bottom 0.178: 45.56,86.36 43.5,86.36 41.75,84.61 41.75,75.41 42.55,74.61 52.39,74.61 | 40.48,31.75 43.66,34.93 52.86,34.93 53.18,35.24 53.18,40.04 J37.P$1
D2  (3 unrouted)
  Bottom 0.178: 38.26,76.04 38.58,76.04 41.12,73.5 62.55,73.5 62.75,73.7 62.85,73.91 62.87,73.93 62.87,73.98 63.32,74.43 J14.P$1 | J42.P$1 71.76,76.2 74.3,76.2 76.36,78.26 76.36,90.01 71.12,95.25 69.53,95.25 68.78,94.49 J53.P$1
D3  (1 unrouted)
D5  (1 unrouted)
D6  (1 unrouted)
  Bottom 0.178: 45.24,72.07 40.8,72.07 38.89,73.98 37.52,73.98 J18.P$1
D7  (4 unrouted)
  Bottom 0.178: 48.9,55.72 53.98,55.72 54.29,55.4 | J5.P$1 37.71,67.39 37.47,67.15 37.47,66.04 40.01,63.5 60.17,63.5 60.8,62.87 63.34,58.26 64.45,56.52 67.19,51.46 67.8,50.4 69.85,47.15 71.28,44.45 70.8,43.97 56.67,43.97 56.48,44.16 J40.P$1
D8  (1 unrouted)
D9  (3 unrouted)
  Bottom 0.178: J26.P$1 30.81,68.74 28.73,68.74 22.54,74.93 22.54,87.47 23.28,88.21 J32.P$1
DO  (1 unrouted)
  Bottom 0.178: J54.P$1 17.46,83.05 17.46,70.49 16.83,69.85 16.74,69.85 J41.P$1
DOUT  (2 unrouted)
GND  (76 unrouted)
  pour Top: 13.02,104.77 86.84,104.77 99.85,82.23 50.01,0 0,82.23
  pour Bottom: 0.16,82.23 13.02,104.77 86.68,104.77 86.84,104.77 99.85,82.23 50.01,0
LEDA  (3 unrouted)
  Bottom 0.178: 52.86,51.12 52.55,51.44 50.32,51.44 50.01,51.12 46.94,51.12 46.78,51.28 46.25,51.28 46.09,51.12 44.29,51.12
N$1  (1 unrouted)
N$2  (2 unrouted)
N$3  (1 unrouted)
N$4  (2 unrouted)
N$5  (1 unrouted)
N$6  (4 unrouted)
  Bottom 0.178: 45.09,31.75 48.26,28.58
  Bottom 0.203: 48.26,28.58 50.96,28.58 51.12,28.73 55.4,28.73 55.56,28.58
N$10  (1 unrouted)
N$11  (4 unrouted)
  Bottom 0.178: 47.94,35.72 47.15,36.51 44.77,36.51
N$12  (1 unrouted)
N$14  (1 unrouted)
N$15  (1 unrouted)
N$16  (3 unrouted)
  Bottom 0.178: 13.18,80.49 13.18,78.11 16.19,75.09 16.19,74.77 | 19.84,71.6 23.81,71.6 24.13,71.91
N$21  (1 unrouted)
N$22  (1 unrouted)
N$23  (1 unrouted)
SCL  (4 unrouted)
SDA  (5 unrouted)
  Bottom 0.178: 46.51,55.72 47.78,56.99 47.75,56.99
  Bottom 0.203: 46.51,55.72 46.2,55.4 43.82,55.4 43.02,54.61 43.02,49.85 43.66,49.21
SWCLK  (1 unrouted)
SWDIO  (1 unrouted)
  Bottom 0.178: 53.98,81.76 53.98,78.58 57.79,74.77 61.59,74.77 62.39,75.57 62.39,80.33 61.93,80.79 JP5.2
USB_D+  (2 unrouted)
  Bottom 0.178: 48.26,84.46 48.26,78.26 48.1,78.11
USB_D-  (2 unrouted)
  Bottom 0.178: 48.42,89.54 47.47,88.58 47.47,76.68
VBUS  (5 unrouted)
VDDANA  (1 unrouted)
VDDCORE  (1 unrouted)
VIN  (2 unrouted)